# Altium schematic sheet Top_Level.SchDoc
size Tabloid; SheetNumber: 2; SheetTotal: 2
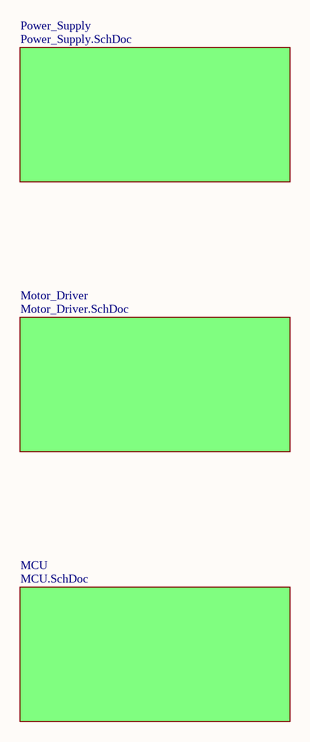
[diagram p0: Top_Level.SchDoc]

## Sub-sheets
MCU = MCU.SchDoc: no entries
Motor_Driver = Motor_Driver.SchDoc: no entries
Power_Supply = Power_Supply.SchDoc: no entries

## Notes on the sheet
- Insert really cool logo here
- Really_Cool_Title:
- Revision:
- Desciption:
- Version:
- Engineer: